# Altium schematic sheet Power.SchDoc
size A4; SheetNumber: 2; SheetTotal: 3
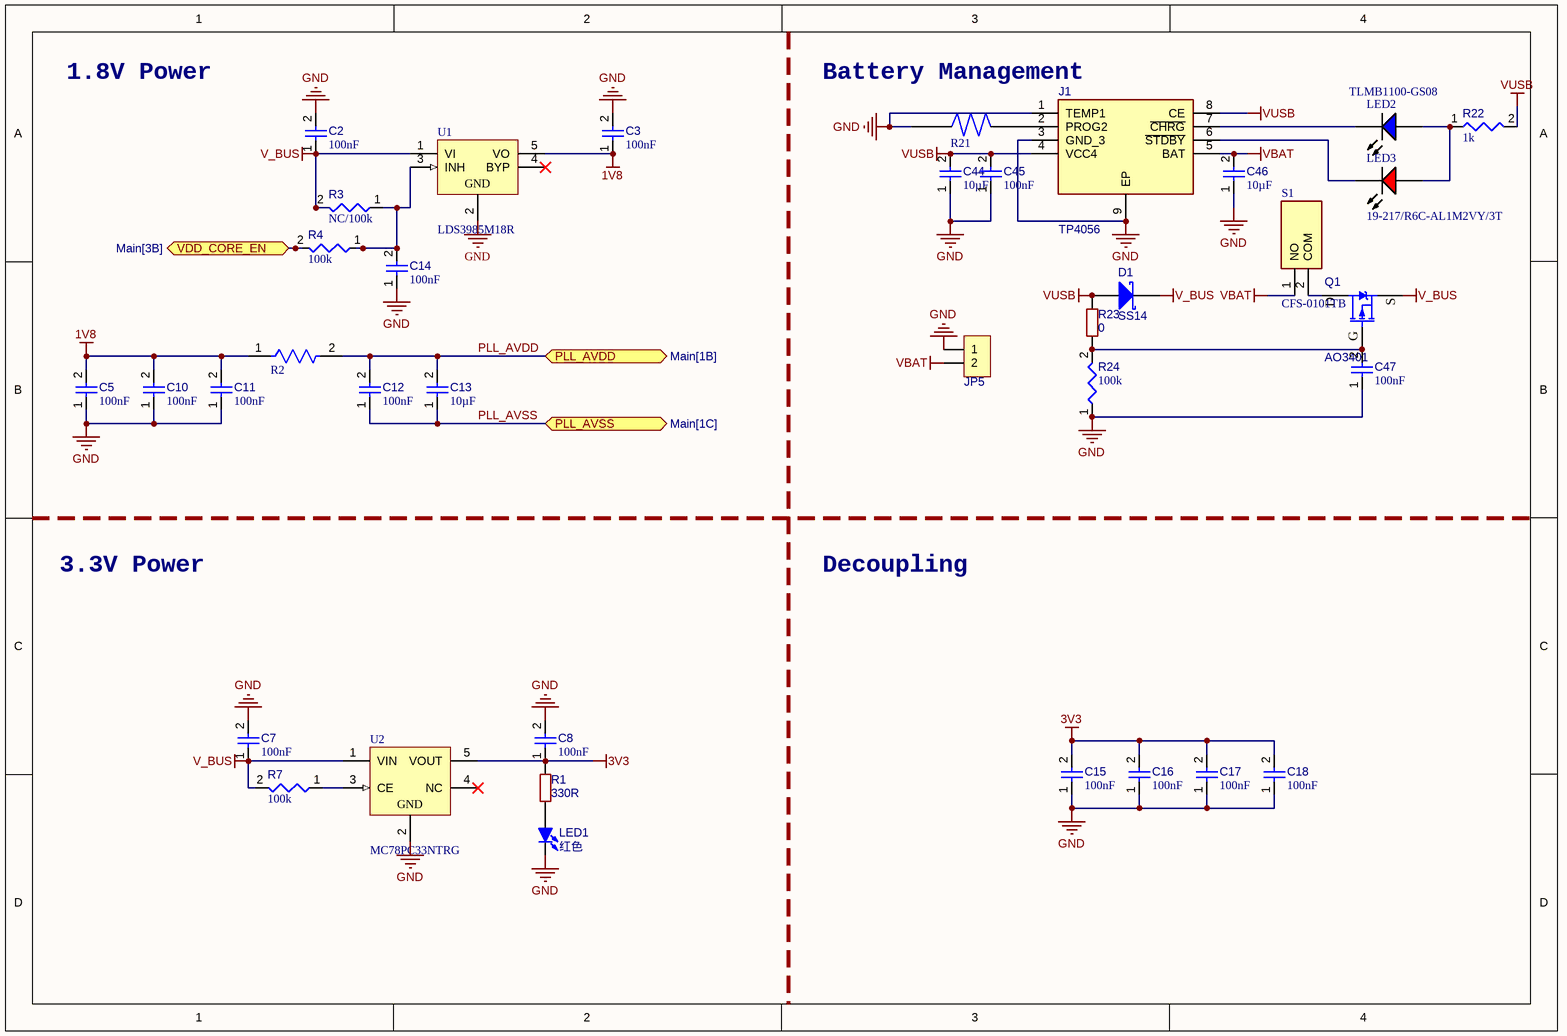
[diagram p0: Power.SchDoc]

## Parts
C2  value 100nF  [CAPC1608X90X40NL10T20]  (hidden comment: Capacitor 100 nF +/-10% 50 V 0603)
C3  value 100nF  [CAPC1608X90X40NL10T20]  (hidden comment: Capacitor 100 nF +/-10% 50 V 0603)
C5  value 100nF  [CAPC1608X90X40NL10T20]  (hidden comment: Capacitor 100 nF +/-10% 50 V 0603)
C7  value 100nF  [CAPC1608X90X40NL10T20]  (hidden comment: Capacitor 100 nF +/-10% 50 V 0603)
C8  value 100nF  [CAPC1608X90X40NL10T20]  (hidden comment: Capacitor 100 nF +/-10% 50 V 0603)
C10  value 100nF  [CAPC1608X90X40NL10T20]  (hidden comment: Capacitor 100 nF +/-10% 50 V 0603)
C11  value 100nF  [CAPC1608X90X40NL10T20]  (hidden comment: Capacitor 100 nF +/-10% 50 V 0603)
C12  value 100nF  [CAPC1608X90X40NL10T20]  (hidden comment: Capacitor 100 nF +/-10% 50 V 0603)
C13  value 10µF  [CAPC0603(1608)100_L]  (hidden comment: Capacitor 10µF +/-20% 10V 0603)
C14  value 100nF  [CAPC1608X90X40NL10T20]  (hidden comment: Capacitor 100 nF +/-10% 50 V 0603)
C15  value 100nF  [CAPC1608X90X40NL10T20]  (hidden comment: Capacitor 100 nF +/-10% 50 V 0603)
C16  value 100nF  [CAPC1608X90X40NL10T20]  (hidden comment: Capacitor 100 nF +/-10% 50 V 0603)
C17  value 100nF  [CAPC1608X90X40NL10T20]  (hidden comment: Capacitor 100 nF +/-10% 50 V 0603)
C18  value 100nF  [CAPC1608X90X40NL10T20]  (hidden comment: Capacitor 100 nF +/-10% 50 V 0603)
C44  value 10µF  [CAPC0603(1608)100_L]  (hidden comment: Capacitor 10µF +/-20% 10V 0603)
C45  value 100nF  [CAPC1608X90X40NL10T20]  (hidden comment: Capacitor 100 nF +/-10% 50 V 0603)
C46  value 10µF  [CAPC0603(1608)100_L]  (hidden comment: Capacitor 10µF +/-20% 10V 0603)
C47  value 100nF  [CAPC1608X90X40NL10T20]  (hidden comment: Capacitor 100 nF +/-10% 50 V 0603)
D1  SS14  [SMA]
J1  TP4056  [SOIC127P600X175-9N]
JP5  HDR-1X2  [XH2.54-LS-2P]  (value not drawn)
LED1  红色  [LED0603_R]
LED2  TLMB1100-GS08  [VISH-TLMX1100-2_V]
LED3  19-217/R6C-AL1M2VY/3T  [EVRL-0603-2_V]
Q1  AO3401  [SOT23-3N]
R1  330R  [R0603_NS]
R2  CRGP0603F100R  [FP-CRGP0603-IPC_B]  (value not drawn)
R3  value NC/100k  [RESC1608X55X25ML10T15]  (hidden comment: Resistor 100k +/-1% 0603 100 mW)
R4  value 100k  [RESC1608X55X25ML10T15]  (hidden comment: Resistor 100k +/-1% 0603 100 mW)
R7  value 100k  [RESC1608X55X25ML10T15]  (hidden comment: Resistor 100k +/-1% 0603 100 mW)
R21  CRCW06031K20FKTA  [CRCW06031K20FKTA-Footprint-1]  (value not drawn)
R22  value 1k  [RESC1608X55X25ML10T15]  (hidden comment: Resistor 1k +/-1% 0603 100 mW)
R23  0  [R0603_NS]
R24  value 100k  [RESC1608X55X25ML10T15]  (hidden comment: Resistor 100k +/-1% 0603 100 mW)
S1  CFS-0101TB  [CFS0101TB]
U1  LDS3985M18R  [SOT23-5L_N]
U2  MC78PC33NTRG  [ONSC-SOT-23-5-1212-01_O_V]

## Ports
PLL_AVDD (bidir, see Main[1B]), PLL_AVSS (bidir, see Main[1C]), VDD_CORE_EN (bidir, see Main[3B])

## Nets
1V8: C3.1 C5.2 C10.2 C11.2 R2.1 U1.5(VO)
3V3: C8.1 C15.2 C16.2 C17.2 C18.2 R1.1 U2.5(VOUT)
GND: C2.2 C3.2 C5.1 C7.2 C8.2 C10.1 C11.1 C14.1 C15.1 C16.1 C17.1 C18.1 C44.1 C45.1 C46.1 C47.1 J1.1(TEMP1) J1.3(GND_3) J1.9(EP) JP5.1 LED1.2(K) R21.1 R24.1 U1.2(GND) U2.2(GND)
V_BUS: C2.1 C7.1 D1.2(K) Q1.2(S) R3.2 R7.2 U1.1(VI) U2.1(VIN)
VBAT: C46.2 J1.5(BAT) JP5.2 S1.1(NO)
VUSB: C44.2 C45.2 D1.1(A) J1.4(VCC4) J1.8(CE) R22.2 R23.2
PLL_AVDD: C12.2 C13.2 R2.2 ; port PLL_AVDD
PLL_AVSS: C12.1 C13.1 ; port PLL_AVSS
VDD_CORE_EN: R4.2 ; port VDD_CORE_EN
NetC14_2: C14.2 R3.1 R4.1 U1.3(INH)
NetC47_2: C47.2 Q1.1(G) R23.1 R24.2
NetJ1_2: J1.2(PROG2) R21.2
NetJ1_6: J1.6(~{STDBY}) LED3.2(K)
NetJ1_7: J1.7(~{CHRG}) LED2.2(K)
NetLED1_1: LED1.1(A) R1.2
NetLED2_1: LED2.1(A) LED3.1(A) R22.1
NetQ1_3: Q1.3(D) S1.2(COM)
NetR7_1: R7.1 U2.3(CE)

Not connected (* = marked no-connect by the designer): U1 4(BYP)*; U2 4(NC)*

## Notes on the sheet
- 1.8V Power
- Battery Management
- 3.3V Power
- Decoupling

## Library data of the parts
C2 C3 C5 C7 C8 C10-C12 C14-C18 C45 C47 = CMP-001-00017-6: Chip Capacitor, 100 nF, +/- 10%, 50 V, 0603 (1608 Metric); Voltage Rating: 50V; Capacitor Type: Ceramic; Tolerance: 10%; Mounting Technology: SM; Max Operating Temperature: 125°C; RoHS Compliant: True; Pins: 2; Case/Package: 0603; Min Operating Temperature: -55°C
C13 C44 C46 = CMP-001-00075-4: Chip Capacitor, 10µF +/-20%, 10V, 0603, Thickness 1 mm; Tolerance: 10%; Voltage Rating: 10V; Max Operating Temperature: 85°C; Pins: 2; Case/Package: 0603; Mounting Technology: SMT; Min Operating Temperature: -55°C
D1 = SS14: 肖特基二极管; 属性: 40V/1A; 以赠品形式获赠本封装库的买家，还可联系卖家免费指导AD软件使用: 封装库来自淘宝卖家ID：黄晶宝石; BOM名称: 肖特基二极管
J1 = TP4056: Connector; Manufacturer_Name: NanJing Top Power; Datasheet Link: https://dlnmh9ip6v2uc.cloudfront.net/datasheets/Prototyping/TP4056.pdf; Height: 1.75mm; Manufacturer_Part_Number: TP4056
JP5 = Header 2: 2P接插件; 联系卖家，免费查找封装: 唯一出售店铺网址https://shop463601444.taobao.com; 封装库来自淘宝卖家ID:黄晶宝石: 其他店铺购入均为盗版假冒封装库，请立即申请退款，本店现金奖励20~200元; BOM名称: 2P接插件
LED1 = LED-SMD: 贴片LED; 封装库来自淘宝卖家ID：黄晶宝石: 其他店铺购入均为盗版封装库，请立即申请退款，本店现金奖励20~200元; BOM名称: 贴片LED
LED2 = CMP-007-00028-2: Blue LED, 10 mA, 3.9 V, -40 to 100 degC, 2-Pin SMD (0603), RoHS, Tape and Reel; Manufacturer: Vishay Semiconductor; Forward Voltage: 3.9V; Viewing Angle: 160degrees; Power: 68mW; Forward Current: 10mA; Lens Style: Diffused; Luminous Intensity: 5mcd; Case/Package: 0603; Datasheet URL: http://download.siliconexpert.com/pdfs/2016/8/7/12/43/26/667/vsh_/manual/379263299541529tlmb1100.pdf; Illumination Colour: Blue; Datasheet Version: Rev. 2.7, 03/2016; Manufacturer URL: http://www.vishay.com/; Package Reference: 0603; Min Operating Temperature: -40°C; Packaging: TapeandReel; RoHS Compliant: True; Nominal Vf: 3.9V; Mounting Technology: SM; Pins: 2; Package Description: 2-Pin Surface Mount Device, Body 1.6 x 0.8 mm; Colour: Blue; Package Quantity: 3000; Max Operating Temperature: 100°C
LED3 = CMP-007-00004-2: Chip LED, Red, 5 V, 25 mA, -40 to 85 degC, 2-Pin SMD (0603), RoHS, Tape and Reel; Manufacturer: Everlight Electronics; Forward Voltage: 2.2V; Lens Style: Clear; Package Reference: 0603; Datasheet Version: Rev. 1, 01/2005; Mounting Technology: SM; RoHS Compliant: False; Datasheet URL: https://datasheet.ciiva.com/4688/el-19-217-r6c-al1m2vy-3tpdf-187026-4688713.pdf; Case/Package: 0603; Colour: Red; Manufacturer URL: http://www.everlight.com/; Package Description: 2-Pin Surface Mount Device, Body 1.6 x 0.8 mm
Q1 = AO3401: P沟道 30V/4.2A; BOM名称: 场效应管; 8元以下特价购入的买家: 还可以联系卖家远程指导AD软件使用; 参数: P沟道 30V/4.2A
R1 R23 = R: 贴片电阻; 联系卖家，免费查找封装: 唯一出售店铺网址https://shop463601444.taobao.com; BOM名称: 贴片电阻
R2 = CMP-009-00180-1: Res Thick Film 0603 100 Ohm 1% 0.25W(1/4W) ±100ppm/C Pad SMD T/R
R3 R4 R7 R24 = CMP-009-00023-5: Chip Resistor, 100 KOhm, +/- 1%, 0.1 W, -55 to 155 degC, 0603 (1608 Metric); Voltage Rating: 50V; Power: 100mW; Max Operating Temperature: 155°C; RoHS Compliant: True; Tolerance: 1%; Pins: 2; Case/Package: 0603; Mounting Technology: SM; Min Operating Temperature: -55°C
R21 = CMP-009-00181-1: Res Thick Film 0603 1.2K Ohm 1% 1/10W ±100ppm/°C Molded SMD SMD Paper T/R
R22 = CMP-009-00014-5: Chip Resistor, 1 KOhm, +/-1%, 0.1 W, -55 to 155 degC, 0603 (1608 Metric); Voltage Rating: 50V; Power: 100mW; Tolerance: 1%; Mounting Technology: SM; Pins: 2; Case/Package: 0603; Min Operating Temperature: -55°C; RoHS Compliant: True; Max Operating Temperature: 155°C
S1 = CFS-0101TB: Switch; Manufacturer_Name: NIDEC COPAL; Datasheet Link: https://au.mouser.com/datasheet/2/972/cfs-1628139.pdf; Height: 4mm; Manufacturer_Part_Number: CFS-0101TB; Mouser Part Number: 229-CFS-0101TB; Mouser Price/Stock: https://www.mouser.co.uk/ProductDetail/Nidec-Copal/CFS-0101TB?qs=XeJtXLiO41RUoaDpyshzOQ%3D%3D
U1 = CMP-019-00049-1: LDS3985 Series 1.8 V 300 mA Fixed Surface Mount Voltage Regulator - SOT-23-5; Max Supply Current: 300uA; Output Voltage: 1.8V; Number of Regulators: 1; Output Configuration: Positive; Max Supply Voltage: 6V; Power Supply Rejection Ratio (PSRR): 50dB; Input Bias Current: 85uA; Output Current: 300mA; Min Input Voltage: 2.5V; Quiescent Current: 150uA; Min Operating Temperature: -40°C; Radiation Hardening: No; Case/Package: SOT-23; Series: -; Packaging: Tape and Reel; Min Output Voltage: 1.8V; Lead Free: Lead Free; Number of Outputs: 1; Output Type: Fixed; RoHS Compliant: Yes; Polarity: Positive; Max Output current: 300mA; Max Operating Temperature: 125°C; Pins: 5; Mounting Technology: Surface Mount; Package Quantity: 3000
U2 = CMP-019-00028-3: Low Noise Low Drop Out (LDO) Linear Voltage Regulator, 3.3 V Output Voltage, 150 mA, -40 to 85 degC, 5-Pin SOT-23 (1212-01), Pb-Free, Tape and Reel; Manufacturer: ON Semiconductor; Outputs: 1; Power Rating: 250mW; Nominal Output Voltage: 3.3V; Min Input Voltage: 4.3V; Dropout Voltage: 300mV; Max Ouput Current: 150mA; Max Input Voltage: 8V; Package Quantity: 3000; Mounting Technology: SM; Case/Package: SOT-23-5; RoHS Compliant: True; Datasheet Version: Rev. 6, 06/2005; Packaging: TapeandReel; Max Operating Temperature: 85°C; Power: 250mW; Output Voltage: 3.3V; Package Reference: SOT-23-5-1212-01_O; Manufacturer URL: http://www.onsemi.com/; Package Description: 5-Pin Small Outline Transistor, Body 2.9 x 1.65 mm, Pitch 0.95 mm; Output Current: 150mA; Datasheet URL: http://www.onsemi.com/pub_link/Collateral/MC78PC00-D.PDF; Min Operating Temperature: -40°C; Pins: 5